# EAGLE board M847 (EAGLE 6.6.0), part 1 of 3
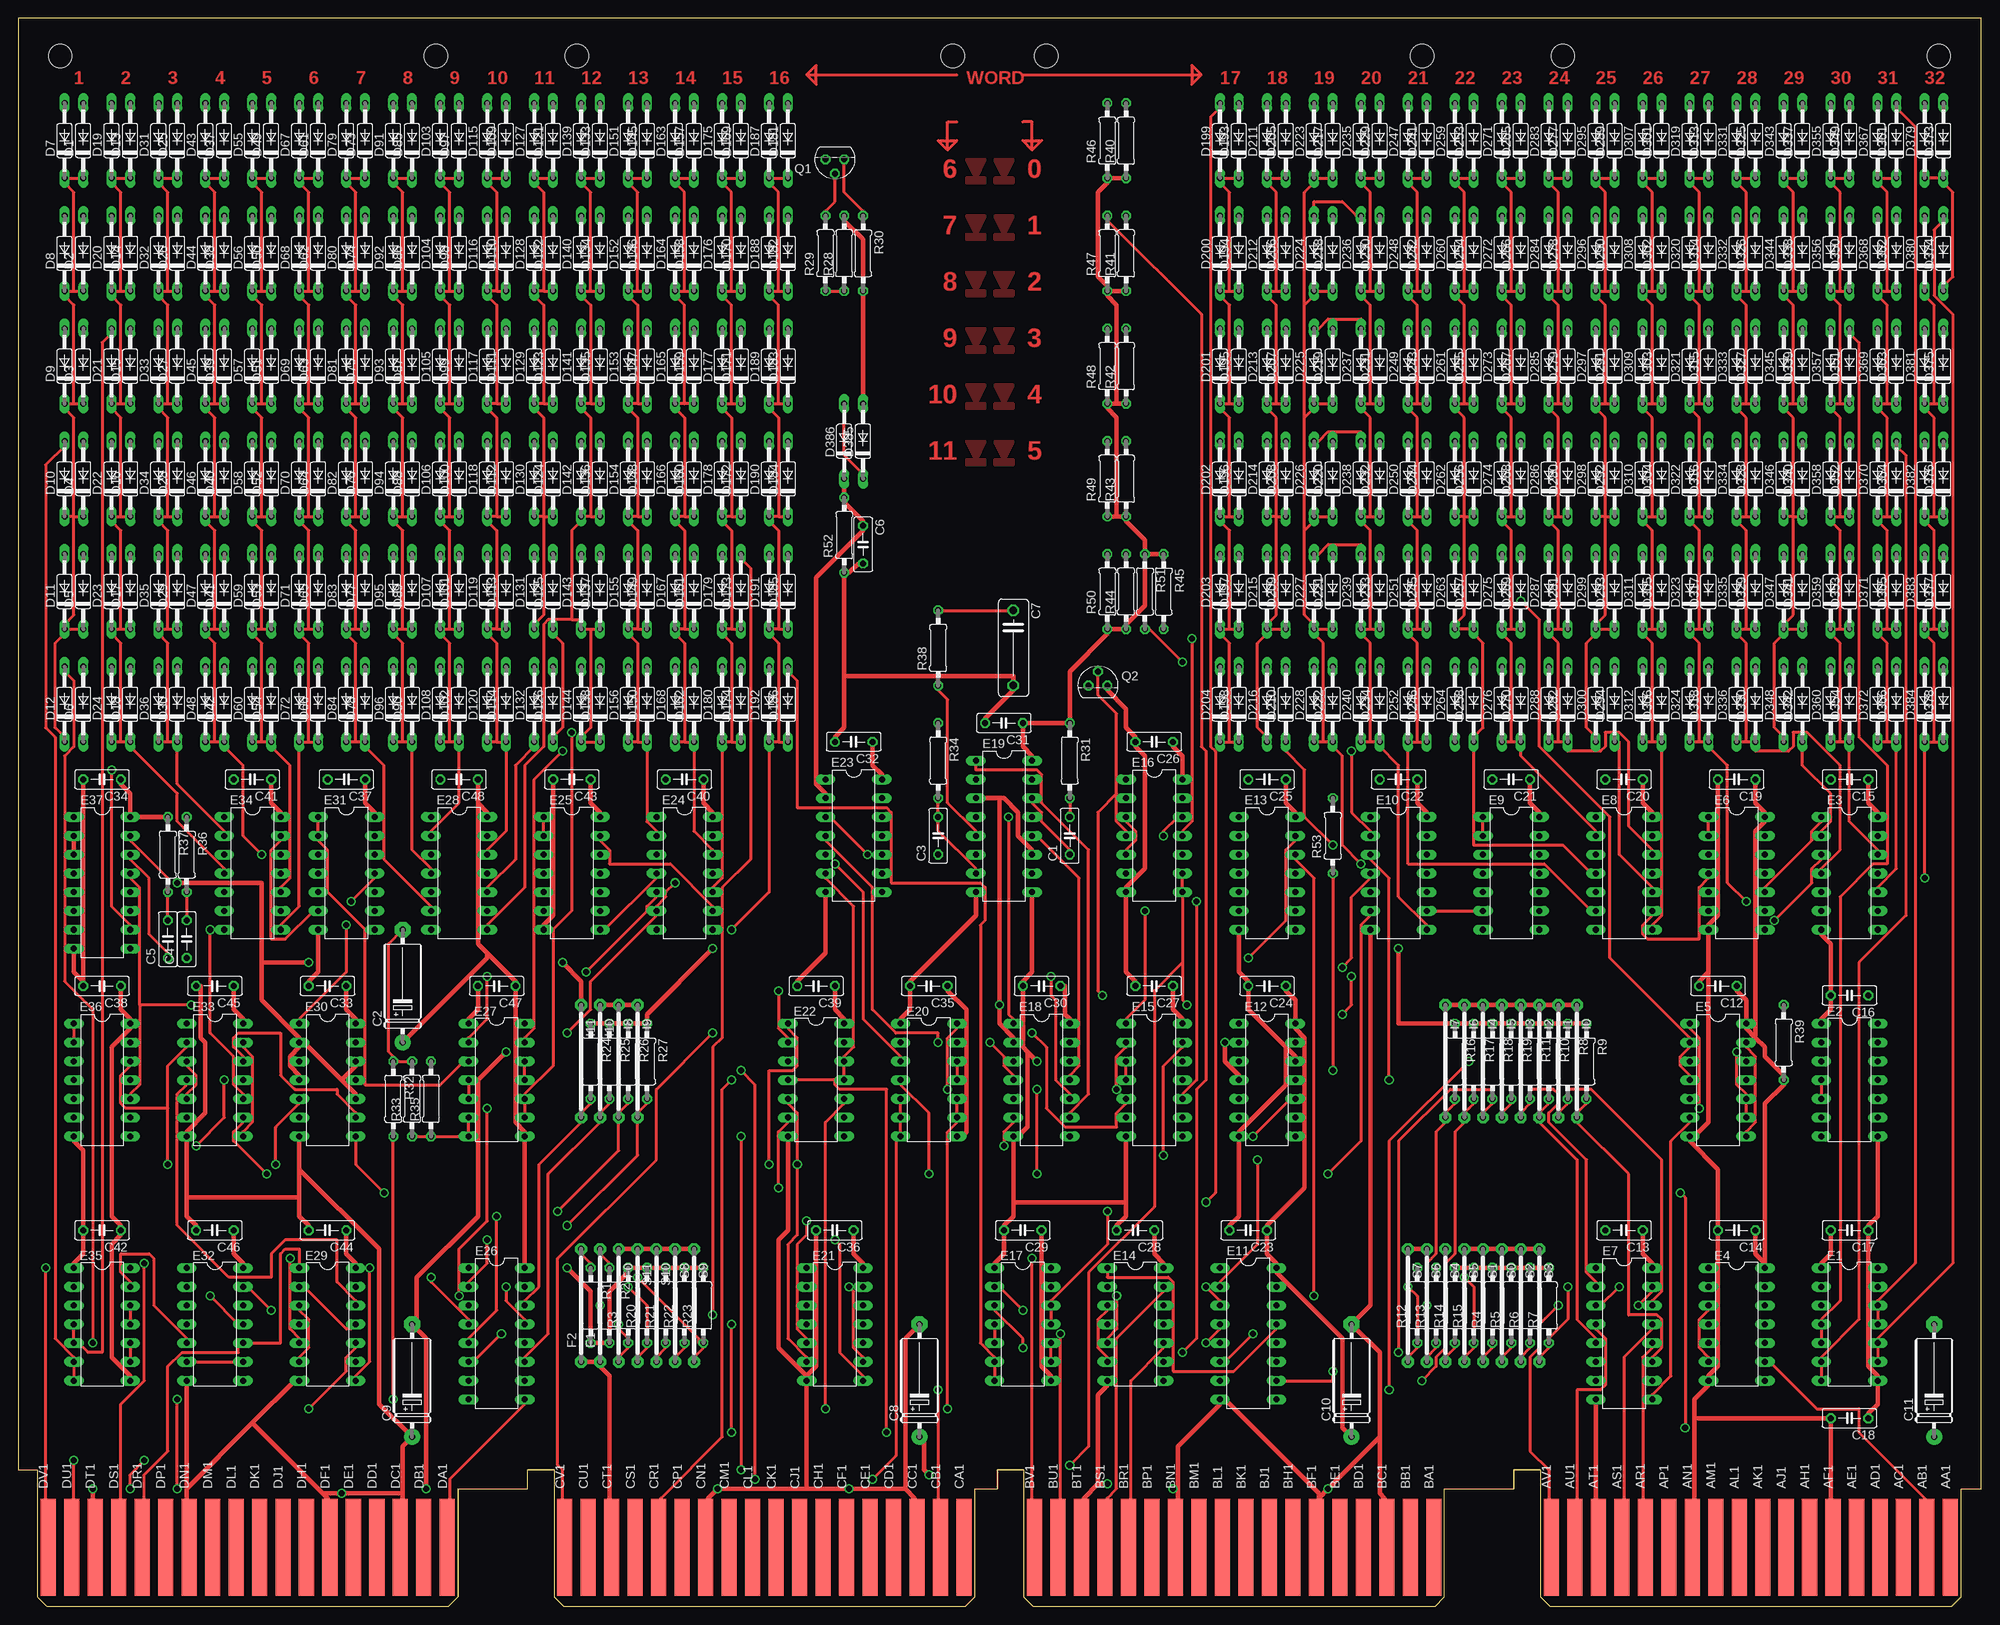
[diagram p3: board, top side]
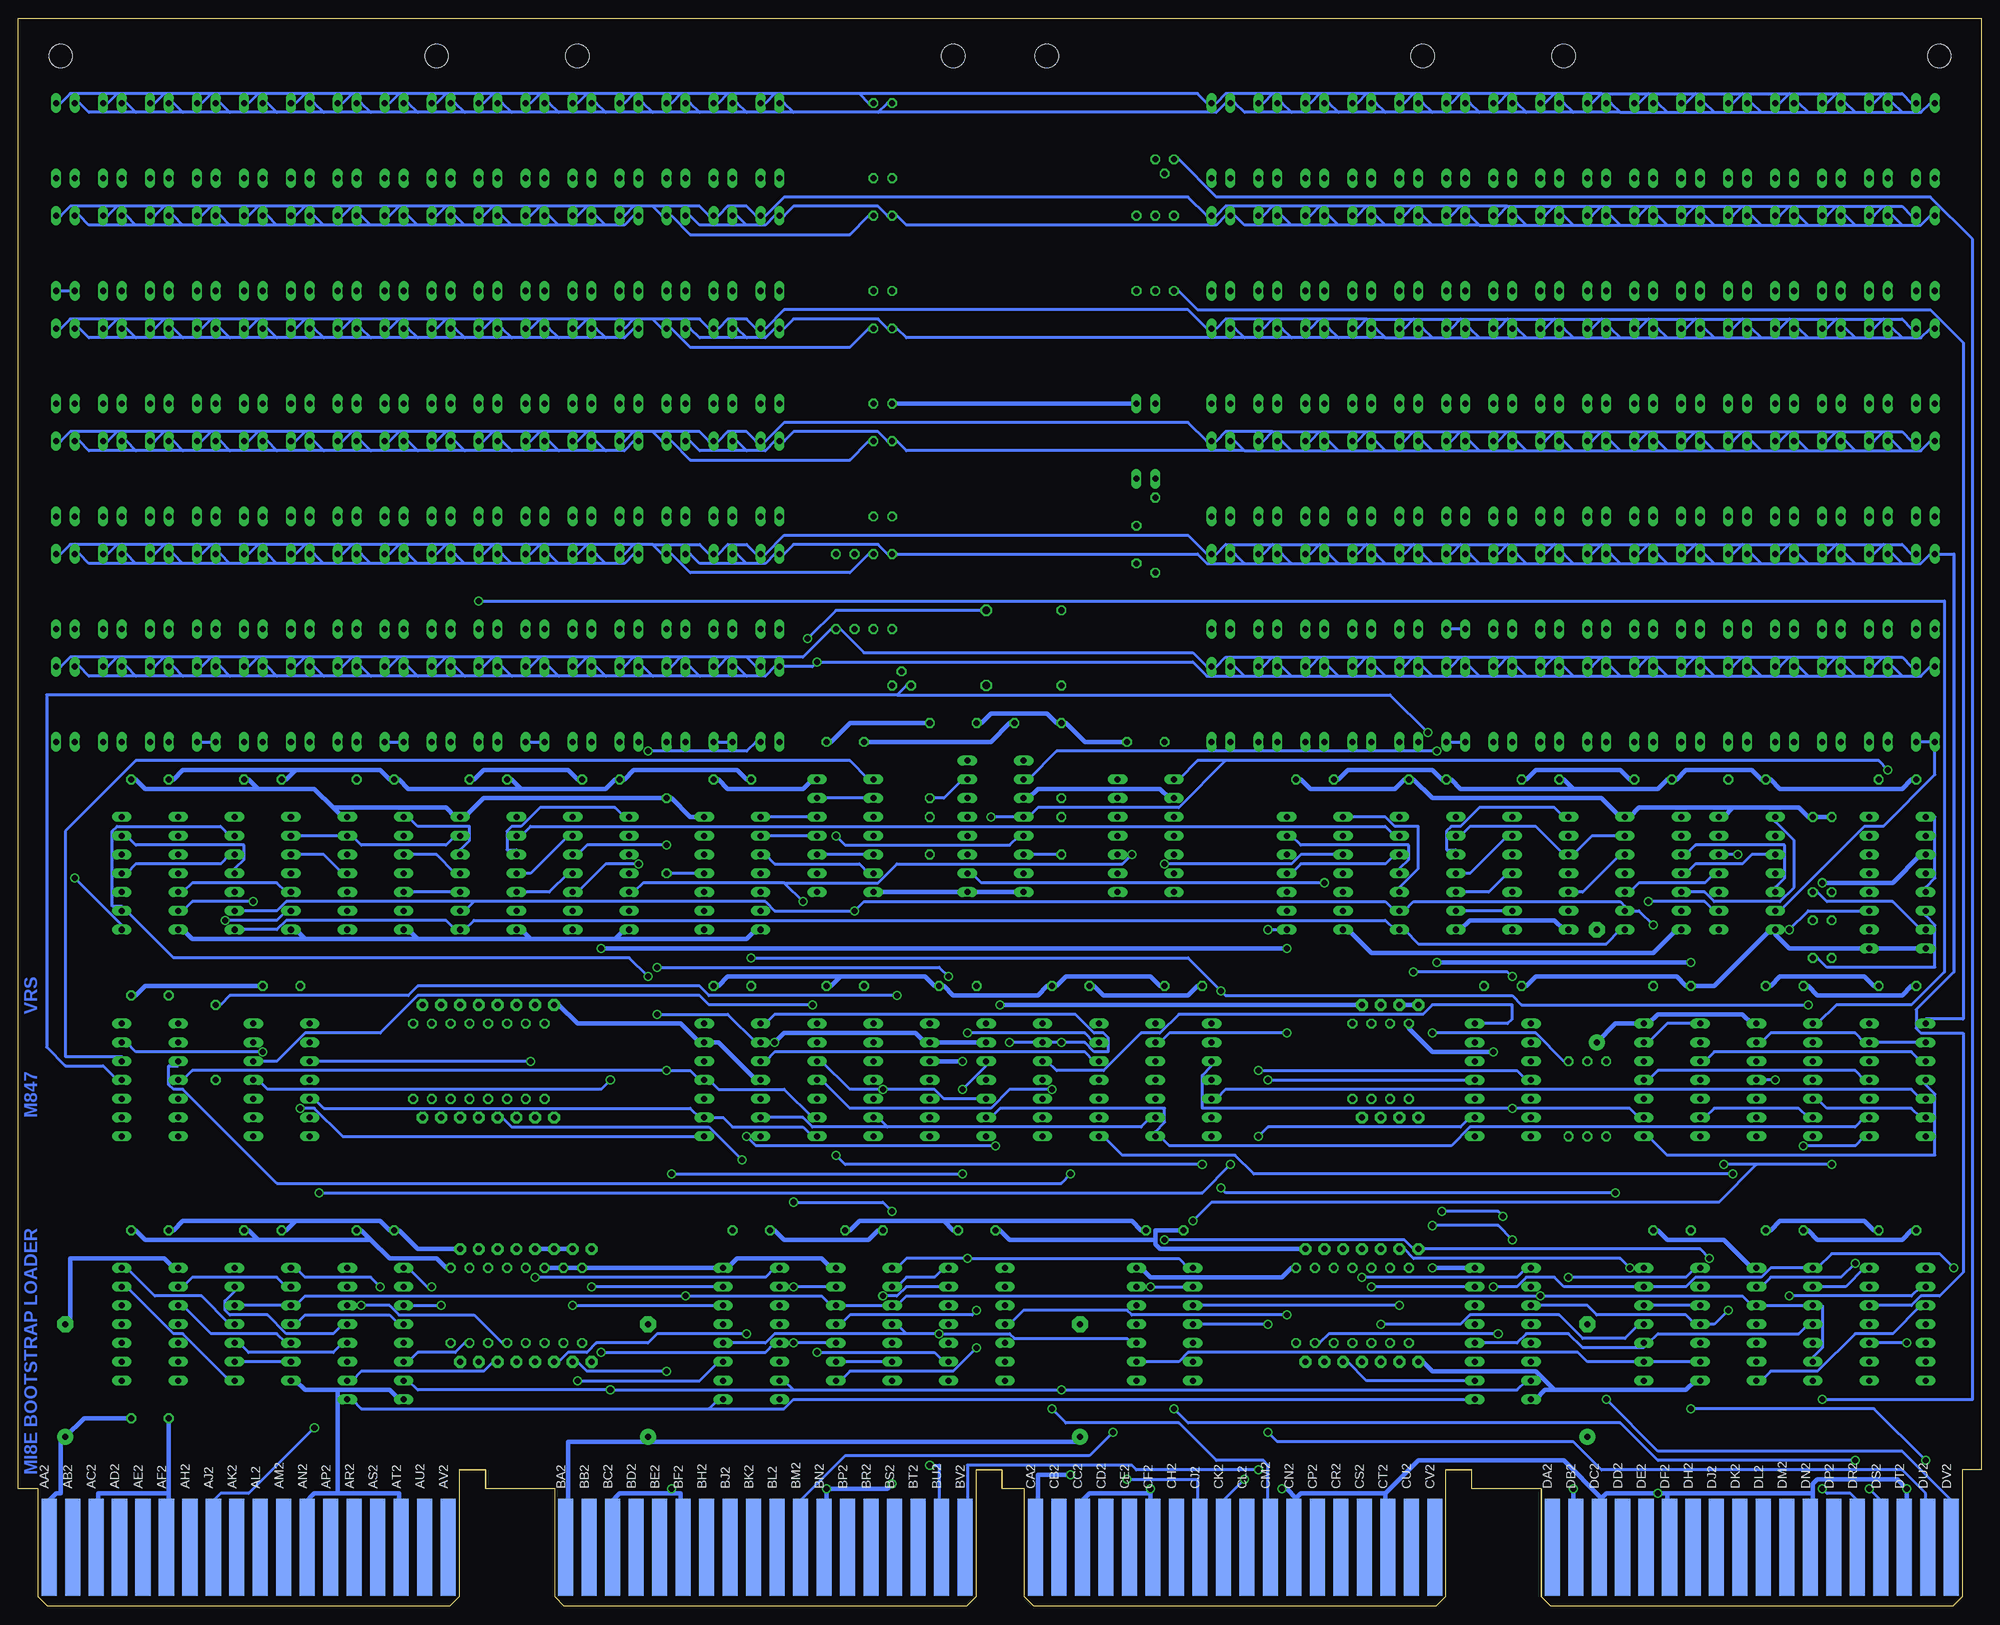
[diagram p4: board, bottom side, seen from below]

Size 265.3 x 214.63 mm. Coordinates in mm from the lower left corner, seen from the top.
Copper layers (1+16): Top 0.035mm / dielectric 1.5mm / Bottom 0.035mm
Design rules "16mils": minimum track width 16mil, minimum drill 32mil, track to track 15mil, track to pad 10mil, pad to pad 10mil, via to via 10mil, smd to smd 10mil, copper to edge 13mil, drill to drill 10mil, minimum pad ring 10mil, minimum via ring 8mil, stop-mask expansion 0mil, vias tented up to drill 0mil, thermal gap 10mil
Net classes: 1 supply: width 0.635 mm

## Footprints (pad centres in the part's own frame; a part is rotated, then mirrored left to right if it is on the bottom)
C050-025X075 = drill 0.813 octagon: 1 -2.54,0; 2 2.54,0
E15-5 = drill 0.813 pad 2.159: + -7.62,0 | drill 0.813 pad 2.159 octagon: - 7.62,0
C102-043X133 = drill 1.016 octagon: 1 -5.08,0; 2 5.08,0
DO35-10 = drill 0.813 long: A 5.08,0; C -5.08,0
DIL14 = drill 0.813 long: 1 -7.62,-3.81; 2 -5.08,-3.81; 3 -2.54,-3.81; 4 0,-3.81; 5 2.54,-3.81; 6 5.08,-3.81; 7 7.62,-3.81; 8 7.62,3.81; 9 5.08,3.81; 10 2.54,3.81; 11 0,3.81; 12 -2.54,3.81; 13 -5.08,3.81; 14 -7.62,3.81
DIL16 = drill 0.813 long: 1 -8.89,-3.81; 2 -6.35,-3.81; 3 -3.81,-3.81; 4 -1.27,-3.81; 5 1.27,-3.81; 6 3.81,-3.81; 7 6.35,-3.81; 8 8.89,-3.81; 9 8.89,3.81; 10 6.35,3.81; 11 3.81,3.81; 12 1.27,3.81; 13 -1.27,3.81; 14 -3.81,3.81; 15 -6.35,3.81; 16 -8.89,3.81
15 = drill 0.813 pad 1.6 octagon: 1 -7.62,0; 2 7.62,0
TO92 = drill 0.813 octagon: 1 1.27,0; 2 0,1.905; 3 -1.27,0
0207/10 = drill 0.813 octagon: 1 -5.08,0; 2 5.08,0
OMNIBUS = hole 3.175: 208.915,209.55; 259.715,209.55; 189.865,209.55; 139.065,209.55; 75.616,209.55; 126.416,209.55; 56.566,209.55; 5.766,209.55
EDGE-CON8 = smd 2.032 x 13.106: AA1 261.303,7.938; AB1 258.127,7.938; AC1 254.952,7.938; AD1 251.778,7.938; AE1 248.602,7.938; AF1 245.428,7.938; AH1 242.252,7.938; AJ1 239.077,7.938; AK1 235.903,7.938; AL1 232.727,7.938; AM1 229.553,7.938; AN1 226.377,7.938; AP1 223.202,7.938; AR1 220.028,7.938; AS1 216.852,7.938; AT1 213.678,7.938; AU1 210.502,7.938; AV1 207.327,7.938; BA1 191.452,7.938; BB1 188.278,7.938; BC1 185.102,7.938; BD1 181.928,7.938; BE1 178.752,7.938; BF1 175.577,7.938; BH1 172.403,7.938; BJ1 169.227,7.938; BK1 166.053,7.938; BL1 162.877,7.938; BM1 159.702,7.938; BN1 156.528,7.938; BP1 153.352,7.938; BR1 150.178,7.938; BS1 147.002,7.938; BT1 143.827,7.938; BU1 140.653,7.938; BV1 137.477,7.938; CA1 127.953,7.938; CB1 124.778,7.938; CC1 121.603,7.938; CD1 118.427,7.938; CE1 115.252,7.938; CF1 112.078,7.938; CH1 108.903,7.938; CJ1 105.728,7.938; CK1 102.552,7.938; CL1 99.377,7.938; CM1 96.203,7.938; CN1 93.028,7.938; CP1 89.853,7.938; CR1 86.677,7.938; CS1 83.502,7.938; CT1 80.328,7.938; CU1 77.153,7.938; CV1 73.978,7.938; DA1 58.102,7.938; DB1 54.928,7.938; DC1 51.752,7.938; DD1 48.578,7.938; DE1 45.403,7.938; DF1 42.227,7.938; DH1 39.053,7.938; DJ1 35.877,7.938; DK1 32.703,7.938; DL1 29.527,7.938; DM1 26.352,7.938; DN1 23.177,7.938; DP1 20.003,7.938; DR1 16.828,7.938; DS1 13.652,7.938; DT1 10.477,7.938; DU1 7.303,7.938; DV1 4.128,7.938 | smd 2.032 x 13.106 bottom: AA2 261.303,7.938; AB2 258.127,7.938; AC2 254.952,7.938; AD2 251.778,7.938; AE2 248.602,7.938; AF2 245.428,7.938; AH2 242.252,7.938; AJ2 239.077,7.938; AK2 235.903,7.938; AL2 232.727,7.938; AM2 229.553,7.938; AN2 226.377,7.938; AP2 223.202,7.938; AR2 220.028,7.938; AS2 216.852,7.938; AT2 213.678,7.938; AU2 210.502,7.938; AV2 207.327,7.938; BA2 191.452,7.938; BB2 188.278,7.938; BC2 185.102,7.938; BD2 181.928,7.938; BE2 178.752,7.938; BF2 175.577,7.938; BH2 172.403,7.938; BJ2 169.227,7.938; BK2 166.053,7.938; BL2 162.877,7.938; BM2 159.702,7.938; BN2 156.528,7.938; BP2 153.352,7.938; BR2 150.178,7.938; BS2 147.002,7.938; BT2 143.827,7.938; BU2 140.653,7.938; BV2 137.477,7.938; CA2 127.953,7.938; CB2 124.778,7.938; CC2 121.603,7.938; CD2 118.427,7.938; CE2 115.252,7.938; CF2 112.078,7.938; CH2 108.903,7.938; CJ2 105.728,7.938; CK2 102.552,7.938; CL2 99.377,7.938; CM2 96.203,7.938; CN2 93.028,7.938; CP2 89.853,7.938; CR2 86.677,7.938; CS2 83.502,7.938; CT2 80.328,7.938; CU2 77.153,7.938; CV2 73.978,7.938; DA2 58.102,7.938; DB2 54.928,7.938; DC2 51.752,7.938; DD2 48.578,7.938; DE2 45.403,7.938; DF2 42.227,7.938; DH2 39.053,7.938; DJ2 35.877,7.938; DK2 32.703,7.938; DL2 29.527,7.938; DM2 26.352,7.938; DN2 23.177,7.938; DP2 20.003,7.938; DR2 16.828,7.938; DS2 13.652,7.938; DT2 10.477,7.938; DU2 7.303,7.938; DV2 4.128,7.938

## Placement (x,y rotation side)
C1  27pf  [C050-025X075]  142.11,104.14 90 top
C2  39uf  [E15-5]  51.94,83.82 90 top
C3  150pf  [C050-025X075]  124.33,104.14 90 top
C4  68pf  [C050-025X075]  22.73,90.17 90 top
C5  27pf  [C050-025X075]  20.19,90.17 90 top
C6  27pf  [C050-025X075]  114.17,143.51 270 top
C7  2700pf  [C102-043X133]  134.49,129.54 270 top
C8  6.8uf  [E15-5]  121.79,30.48 90 top
C9  6.8uf  [E15-5]  53.21,30.48 90 top
C10  6.8uf  [E15-5]  180.21,30.48 90 top
C11  6.8uf  [E15-5]  258.95,30.48 90 top
C12  .01uf  [C050-025X075]  229.74,83.82 180 top
C13  .01uf  [C050-025X075]  217.04,50.8 180 top
C14  .01uf  [C050-025X075]  232.28,50.8 180 top
C15  .01uf  [C050-025X075]  247.52,111.76 180 top
C16  .01uf  [C050-025X075]  247.52,82.55 180 top
C17  .01uf  [C050-025X075]  247.52,50.8 180 top
C18  .01uf  [C050-025X075]  247.52,25.4 180 top
C19  .01uf  [C050-025X075]  232.28,111.76 180 top
C20  .01uf  [C050-025X075]  217.04,111.76 180 top
C21  .01uf  [C050-025X075]  201.8,111.76 180 top
C22  .01uf  [C050-025X075]  186.56,111.76 180 top
C23  .01uf  [C050-025X075]  166.24,50.8 180 top
C24  .01uf  [C050-025X075]  168.78,83.82 180 top
C25  .01uf  [C050-025X075]  168.78,111.76 180 top
C26  .01uf  [C050-025X075]  153.54,116.84 180 top
C27  .01uf  [C050-025X075]  153.54,83.82 180 top
C28  .01uf  [C050-025X075]  151,50.8 180 top
C29  .01uf  [C050-025X075]  135.76,50.8 180 top
C30  .01uf  [C050-025X075]  138.3,83.82 180 top
C31  .01uf  [C050-025X075]  133.22,119.38 180 top
C32  .01uf  [C050-025X075]  112.9,116.84 180 top
C33  .01uf  [C050-025X075]  41.78,83.82 180 top
C34  .01uf  [C050-025X075]  11.3,111.76 180 top
C35  .01uf  [C050-025X075]  123.06,83.82 180 top
C36  .01uf  [C050-025X075]  110.36,50.8 180 top
C37  .01uf  [C050-025X075]  44.32,111.76 180 top
C38  .01uf  [C050-025X075]  11.3,83.82 180 top
C39  .01uf  [C050-025X075]  107.82,83.82 180 top
C40  .01uf  [C050-025X075]  90.04,111.76 180 top
C41  .01uf  [C050-025X075]  31.62,111.76 180 top
C42  .01uf  [C050-025X075]  11.3,50.8 180 top
C43  .01uf  [C050-025X075]  74.8,111.76 180 top
C44  .01uf  [C050-025X075]  41.78,50.8 180 top
C45  .01uf  [C050-025X075]  26.54,83.82 180 top
C46  .01uf  [C050-025X075]  26.54,50.8 180 top
C47  .01uf  [C050-025X075]  64.64,83.82 180 top
C48  .01uf  [C050-025X075]  59.56,111.76 180 top
D1  D664  [DO35-10]  8.76,198.12 90 top
D2  D664  [DO35-10]  8.76,182.88 90 top
D3  D664  [DO35-10]  8.76,167.64 90 top
D4  D664  [DO35-10]  8.76,152.4 90 top
D5  D664  [DO35-10]  8.76,137.16 90 top
D6  D664  [DO35-10]  8.76,121.92 90 top
D7  D664  [DO35-10]  6.22,198.12 90 top
D8  D664  [DO35-10]  6.22,182.88 90 top
D9  D664  [DO35-10]  6.22,167.64 90 top
D10  D664  [DO35-10]  6.22,152.4 90 top
D11  D664  [DO35-10]  6.22,137.16 90 top
D12  D664  [DO35-10]  6.22,121.92 90 top
D13  D664  [DO35-10]  15.11,198.12 90 top
D14  D664  [DO35-10]  15.11,182.88 90 top
D15  D664  [DO35-10]  15.11,167.64 90 top
D16  D664  [DO35-10]  15.11,152.4 90 top
D17  D664  [DO35-10]  15.11,137.16 90 top
D18  D664  [DO35-10]  15.11,121.92 90 top
D19  D664  [DO35-10]  12.57,198.12 90 top
D20  D664  [DO35-10]  12.57,182.88 90 top
D21  D664  [DO35-10]  12.57,167.64 90 top
D22  D664  [DO35-10]  12.57,152.4 90 top
D23  D664  [DO35-10]  12.57,137.16 90 top
D24  D664  [DO35-10]  12.57,121.92 90 top
D25  D664  [DO35-10]  21.46,198.12 90 top
D26  D664  [DO35-10]  21.46,182.88 90 top
D27  D664  [DO35-10]  21.46,167.64 90 top
D28  D664  [DO35-10]  21.46,152.4 90 top
D29  D664  [DO35-10]  21.46,137.16 90 top
D30  D664  [DO35-10]  21.46,121.92 90 top
D31  D664  [DO35-10]  18.92,198.12 90 top
D32  D664  [DO35-10]  18.92,182.88 90 top
D33  D664  [DO35-10]  18.92,167.64 90 top
D34  D664  [DO35-10]  18.92,152.4 90 top
D35  D664  [DO35-10]  18.92,137.16 90 top
D36  D664  [DO35-10]  18.92,121.92 90 top
D37  D664  [DO35-10]  27.81,198.12 90 top
D38  D664  [DO35-10]  27.81,182.88 90 top
D39  D664  [DO35-10]  27.81,167.64 90 top
D40  D664  [DO35-10]  27.81,152.4 90 top
D41  D664  [DO35-10]  27.81,137.16 90 top
D42  D664  [DO35-10]  27.81,121.92 90 top
D43  D664  [DO35-10]  25.27,198.12 90 top
D44  D664  [DO35-10]  25.27,182.88 90 top
D45  D664  [DO35-10]  25.27,167.64 90 top
D46  D664  [DO35-10]  25.27,152.4 90 top
D47  D664  [DO35-10]  25.27,137.16 90 top
D48  D664  [DO35-10]  25.27,121.92 90 top
D49  D664  [DO35-10]  34.16,198.12 90 top
D50  D664  [DO35-10]  34.16,182.88 90 top
D51  D664  [DO35-10]  34.16,167.64 90 top
D52  D664  [DO35-10]  34.16,152.4 90 top
D53  D664  [DO35-10]  34.16,137.16 90 top
D54  D664  [DO35-10]  34.16,121.92 90 top
D55  D664  [DO35-10]  31.62,198.12 90 top
D56  D664  [DO35-10]  31.62,182.88 90 top
D57  D664  [DO35-10]  31.62,167.64 90 top
D58  D664  [DO35-10]  31.62,152.4 90 top
D59  D664  [DO35-10]  31.62,137.16 90 top
D60  D664  [DO35-10]  31.62,121.92 90 top
D61  D664  [DO35-10]  40.51,198.12 90 top
D62  D664  [DO35-10]  40.51,182.88 90 top
D63  D664  [DO35-10]  40.51,167.64 90 top
D64  D664  [DO35-10]  40.51,152.4 90 top
D65  D664  [DO35-10]  40.51,137.16 90 top
D66  D664  [DO35-10]  40.51,121.92 90 top
D67  D664  [DO35-10]  37.97,198.12 90 top
D68  D664  [DO35-10]  37.97,182.88 90 top
D69  D664  [DO35-10]  37.97,167.64 90 top
D70  D664  [DO35-10]  37.97,152.4 90 top
D71  D664  [DO35-10]  37.97,137.16 90 top
D72  D664  [DO35-10]  37.97,121.92 90 top
D73  D664  [DO35-10]  46.86,198.12 90 top
D74  D664  [DO35-10]  46.86,182.88 90 top
D75  D664  [DO35-10]  46.86,167.64 90 top
D76  D664  [DO35-10]  46.86,152.4 90 top
D77  D664  [DO35-10]  46.86,137.16 90 top
D78  D664  [DO35-10]  46.86,121.92 90 top
D79  D664  [DO35-10]  44.32,198.12 90 top
D80  D664  [DO35-10]  44.32,182.88 90 top
D81  D664  [DO35-10]  44.32,167.64 90 top
D82  D664  [DO35-10]  44.32,152.4 90 top
D83  D664  [DO35-10]  44.32,137.16 90 top
D84  D664  [DO35-10]  44.32,121.92 90 top
D85  D664  [DO35-10]  53.21,198.12 90 top
D86  D664  [DO35-10]  53.21,182.88 90 top
D87  D664  [DO35-10]  53.21,167.64 90 top
D88  D664  [DO35-10]  53.21,152.4 90 top
D89  D664  [DO35-10]  53.21,137.16 90 top
D90  D664  [DO35-10]  53.21,121.92 90 top
D91  D664  [DO35-10]  50.67,198.12 90 top
D92  D664  [DO35-10]  50.67,182.88 90 top
D93  D664  [DO35-10]  50.67,167.64 90 top
D94  D664  [DO35-10]  50.67,152.4 90 top
D95  D664  [DO35-10]  50.67,137.16 90 top
D96  D664  [DO35-10]  50.67,121.92 90 top
D97  D664  [DO35-10]  59.56,198.12 90 top
D98  D664  [DO35-10]  59.56,182.88 90 top
D99  D664  [DO35-10]  59.56,167.64 90 top
D100  D664  [DO35-10]  59.56,152.4 90 top
D101  D664  [DO35-10]  59.56,137.16 90 top
D102  D664  [DO35-10]  59.56,121.92 90 top
D103  D664  [DO35-10]  57.02,198.12 90 top
D104  D664  [DO35-10]  57.02,182.88 90 top
D105  D664  [DO35-10]  57.02,167.64 90 top
D106  D664  [DO35-10]  57.02,152.4 90 top
D107  D664  [DO35-10]  57.02,137.16 90 top
D108  D664  [DO35-10]  57.02,121.92 90 top
D109  D664  [DO35-10]  65.91,198.12 90 top
D110  D664  [DO35-10]  65.91,182.88 90 top
D111  D664  [DO35-10]  65.91,167.64 90 top
D112  D664  [DO35-10]  65.91,152.4 90 top
D113  D664  [DO35-10]  65.91,137.16 90 top
D114  D664  [DO35-10]  65.91,121.92 90 top
D115  D664  [DO35-10]  63.37,198.12 90 top
D116  D664  [DO35-10]  63.37,182.88 90 top
D117  D664  [DO35-10]  63.37,167.64 90 top
D118  D664  [DO35-10]  63.37,152.4 90 top
D119  D664  [DO35-10]  63.37,137.16 90 top
D120  D664  [DO35-10]  63.37,121.92 90 top
D121  D664  [DO35-10]  72.26,198.12 90 top
D122  D664  [DO35-10]  72.26,182.88 90 top
D123  D664  [DO35-10]  72.26,167.64 90 top
D124  D664  [DO35-10]  72.26,152.4 90 top
D125  D664  [DO35-10]  72.26,137.16 90 top
D126  D664  [DO35-10]  72.26,121.92 90 top
D127  D664  [DO35-10]  69.72,198.12 90 top
D128  D664  [DO35-10]  69.72,182.88 90 top
D129  D664  [DO35-10]  69.72,167.64 90 top
D130  D664  [DO35-10]  69.72,152.4 90 top
D131  D664  [DO35-10]  69.72,137.16 90 top
D132  D664  [DO35-10]  69.72,121.92 90 top
D133  D664  [DO35-10]  78.61,198.12 90 top
D134  D664  [DO35-10]  78.61,182.88 90 top
D135  D664  [DO35-10]  78.61,167.64 90 top
D136  D664  [DO35-10]  78.61,152.4 90 top
D137  D664  [DO35-10]  78.61,137.16 90 top
D138  D664  [DO35-10]  78.61,121.92 90 top
D139  D664  [DO35-10]  76.07,198.12 90 top
D140  D664  [DO35-10]  76.07,182.88 90 top
D141  D664  [DO35-10]  76.07,167.64 90 top
D142  D664  [DO35-10]  76.07,152.4 90 top
D143  D664  [DO35-10]  76.07,137.16 90 top
D144  D664  [DO35-10]  76.07,121.92 90 top
D145  D664  [DO35-10]  84.96,198.12 90 top
D146  D664  [DO35-10]  84.96,182.88 90 top
D147  D664  [DO35-10]  84.96,167.64 90 top
D148  D664  [DO35-10]  84.96,152.4 90 top
D149  D664  [DO35-10]  84.96,137.16 90 top
D150  D664  [DO35-10]  84.96,121.92 90 top
D151  D664  [DO35-10]  82.42,198.12 90 top
D152  D664  [DO35-10]  82.42,182.88 90 top
D153  D664  [DO35-10]  82.42,167.64 90 top
D154  D664  [DO35-10]  82.42,152.4 90 top
D155  D664  [DO35-10]  82.42,137.16 90 top
D156  D664  [DO35-10]  82.42,121.92 90 top
D157  D664  [DO35-10]  91.31,198.12 90 top
D158  D664  [DO35-10]  91.31,182.88 90 top
D159  D664  [DO35-10]  91.31,167.64 90 top
D160  D664  [DO35-10]  91.31,152.4 90 top
D161  D664  [DO35-10]  91.31,137.16 90 top
D162  D664  [DO35-10]  91.31,121.92 90 top
D163  D664  [DO35-10]  88.77,198.12 90 top
D164  D664  [DO35-10]  88.77,182.88 90 top
D165  D664  [DO35-10]  88.77,167.64 90 top
D166  D664  [DO35-10]  88.77,152.4 90 top
D167  D664  [DO35-10]  88.77,137.16 90 top
D168  D664  [DO35-10]  88.77,121.92 90 top
D169  D664  [DO35-10]  97.66,198.12 90 top
D170  D664  [DO35-10]  97.66,182.88 90 top
D171  D664  [DO35-10]  97.66,167.64 90 top
D172  D664  [DO35-10]  97.66,152.4 90 top
D173  D664  [DO35-10]  97.66,137.16 90 top
D174  D664  [DO35-10]  97.66,121.92 90 top
D175  D664  [DO35-10]  95.12,198.12 90 top
D176  D664  [DO35-10]  95.12,182.88 90 top
D177  D664  [DO35-10]  95.12,167.64 90 top
D178  D664  [DO35-10]  95.12,152.4 90 top
D179  D664  [DO35-10]  95.12,137.16 90 top
D180  D664  [DO35-10]  95.12,121.92 90 top
D181  D664  [DO35-10]  104.01,198.12 90 top
D182  D664  [DO35-10]  104.01,182.88 90 top
D183  D664  [DO35-10]  104.01,167.64 90 top
D184  D664  [DO35-10]  104.01,152.4 90 top
D185  D664  [DO35-10]  104.01,137.16 90 top
D186  D664  [DO35-10]  104.01,121.92 90 top
D187  D664  [DO35-10]  101.47,198.12 90 top
D188  D664  [DO35-10]  101.47,182.88 90 top
D189  D664  [DO35-10]  101.47,167.64 90 top
D190  D664  [DO35-10]  101.47,152.4 90 top
D191  D664  [DO35-10]  101.47,137.16 90 top
D192  D664  [DO35-10]  101.47,121.92 90 top
D193  D664  [DO35-10]  164.97,198.12 90 top
D194  D664  [DO35-10]  164.97,182.88 90 top
D195  D664  [DO35-10]  164.97,167.64 90 top
D196  D664  [DO35-10]  164.97,152.4 90 top
D197  D664  [DO35-10]  164.97,137.16 90 top
D198  D664  [DO35-10]  164.97,121.92 90 top
D199  D664  [DO35-10]  162.43,198.12 90 top
D200  D664  [DO35-10]  162.43,182.88 90 top
D201  D664  [DO35-10]  162.43,167.64 90 top
D202  D664  [DO35-10]  162.43,152.4 90 top
D203  D664  [DO35-10]  162.43,137.16 90 top
D204  D664  [DO35-10]  162.43,121.92 90 top
D205  D664  [DO35-10]  171.32,198.12 90 top
D206  D664  [DO35-10]  171.32,182.88 90 top
D207  D664  [DO35-10]  171.32,167.64 90 top
D208  D664  [DO35-10]  171.32,152.4 90 top
D209  D664  [DO35-10]  171.32,137.16 90 top
D210  D664  [DO35-10]  171.32,121.92 90 top
D211  D664  [DO35-10]  168.78,198.12 90 top
D212  D664  [DO35-10]  168.78,182.88 90 top
D213  D664  [DO35-10]  168.78,167.64 90 top
D214  D664  [DO35-10]  168.78,152.4 90 top
D215  D664  [DO35-10]  168.78,137.16 90 top
D216  D664  [DO35-10]  168.78,121.92 90 top
D217  D664  [DO35-10]  177.67,198.12 90 top
D218  D664  [DO35-10]  177.67,182.88 90 top
D219  D664  [DO35-10]  177.67,167.64 90 top
D220  D664  [DO35-10]  177.67,152.4 90 top
D221  D664  [DO35-10]  177.67,137.16 90 top
D222  D664  [DO35-10]  177.67,121.92 90 top
D223  D664  [DO35-10]  175.13,198.12 90 top
D224  D664  [DO35-10]  175.13,182.88 90 top
D225  D664  [DO35-10]  175.13,167.64 90 top
D226  D664  [DO35-10]  175.13,152.4 90 top
D227  D664  [DO35-10]  175.13,137.16 90 top
D228  D664  [DO35-10]  175.13,121.92 90 top
D229  D664  [DO35-10]  184.02,198.12 90 top
D230  D664  [DO35-10]  184.02,182.88 90 top
D231  D664  [DO35-10]  184.02,167.64 90 top
D232  D664  [DO35-10]  184.02,152.4 90 top
D233  D664  [DO35-10]  184.02,137.16 90 top
D234  D664  [DO35-10]  184.02,121.92 90 top
D235  D664  [DO35-10]  181.48,198.12 90 top
D236  D664  [DO35-10]  181.48,182.88 90 top
D237  D664  [DO35-10]  181.48,167.64 90 top
D238  D664  [DO35-10]  181.48,152.4 90 top
D239  D664  [DO35-10]  181.48,137.16 90 top
D240  D664  [DO35-10]  181.48,121.92 90 top
D241  D664  [DO35-10]  190.37,198.12 90 top
D242  D664  [DO35-10]  190.37,182.88 90 top
D243  D664  [DO35-10]  190.37,167.64 90 top
D244  D664  [DO35-10]  190.37,152.4 90 top
D245  D664  [DO35-10]  190.37,137.16 90 top
D246  D664  [DO35-10]  190.37,121.92 90 top
D247  D664  [DO35-10]  187.83,198.12 90 top
D248  D664  [DO35-10]  187.83,182.88 90 top
D249  D664  [DO35-10]  187.83,167.64 90 top
D250  D664  [DO35-10]  187.83,152.4 90 top
D251  D664  [DO35-10]  187.83,137.16 90 top
D252  D664  [DO35-10]  187.83,121.92 90 top
D253  D664  [DO35-10]  196.72,198.12 90 top
D254  D664  [DO35-10]  196.72,182.88 90 top
D255  D664  [DO35-10]  196.72,167.64 90 top
D256  D664  [DO35-10]  196.72,152.4 90 top
D257  D664  [DO35-10]  196.72,137.16 90 top
D258  D664  [DO35-10]  196.72,121.92 90 top
D259  D664  [DO35-10]  194.18,198.12 90 top
D260  D664  [DO35-10]  194.18,182.88 90 top
D261  D664  [DO35-10]  194.18,167.64 90 top
D262  D664  [DO35-10]  194.18,152.4 90 top
D263  D664  [DO35-10]  194.18,137.16 90 top
D264  D664  [DO35-10]  194.18,121.92 90 top
D265  D664  [DO35-10]  203.07,198.12 90 top
D266  D664  [DO35-10]  203.07,182.88 90 top
D267  D664  [DO35-10]  203.07,167.64 90 top
D268  D664  [DO35-10]  203.07,152.4 90 top
D269  D664  [DO35-10]  203.07,137.16 90 top
D270  D664  [DO35-10]  203.07,121.92 90 top
D271  D664  [DO35-10]  200.53,198.12 90 top
D272  D664  [DO35-10]  200.53,182.88 90 top
D273  D664  [DO35-10]  200.53,167.64 90 top
D274  D664  [DO35-10]  200.53,152.4 90 top
D275  D664  [DO35-10]  200.53,137.16 90 top
D276  D664  [DO35-10]  200.53,121.92 90 top
D277  D664  [DO35-10]  209.42,198.12 90 top
D278  D664  [DO35-10]  209.42,182.88 90 top
D279  D664  [DO35-10]  209.42,167.64 90 top
D280  D664  [DO35-10]  209.42,152.4 90 top
D281  D664  [DO35-10]  209.42,137.16 90 top
D282  D664  [DO35-10]  209.42,121.92 90 top
D283  D664  [DO35-10]  206.88,198.12 90 top
D284  D664  [DO35-10]  206.88,182.88 90 top
D285  D664  [DO35-10]  206.88,167.64 90 top
D286  D664  [DO35-10]  206.88,152.4 90 top
D287  D664  [DO35-10]  206.88,137.16 90 top
D288  D664  [DO35-10]  206.88,121.92 90 top
D289  D664  [DO35-10]  215.77,198.12 90 top
D290  D664  [DO35-10]  215.77,182.88 90 top
D291  D664  [DO35-10]  215.77,167.64 90 top
D292  D664  [DO35-10]  215.77,152.4 90 top
D293  D664  [DO35-10]  215.77,137.16 90 top
D294  D664  [DO35-10]  215.77,121.92 90 top
D295  D664  [DO35-10]  213.23,198.12 90 top
D296  D664  [DO35-10]  213.23,182.88 90 top
D297  D664  [DO35-10]  213.23,167.64 90 top
D298  D664  [DO35-10]  213.23,152.4 90 top
D299  D664  [DO35-10]  213.23,137.16 90 top
D300  D664  [DO35-10]  213.23,121.92 90 top
D301  D664  [DO35-10]  222.12,198.12 90 top
D302  D664  [DO35-10]  222.12,182.88 90 top
D303  D664  [DO35-10]  222.12,167.64 90 top
D304  D664  [DO35-10]  222.12,152.4 90 top
D305  D664  [DO35-10]  222.12,137.16 90 top
D306  D664  [DO35-10]  222.12,121.92 90 top
D307  D664  [DO35-10]  219.58,198.12 90 top
D308  D664  [DO35-10]  219.58,182.88 90 top
D309  D664  [DO35-10]  219.58,167.64 90 top
D310  D664  [DO35-10]  219.58,152.4 90 top
D311  D664  [DO35-10]  219.58,137.16 90 top
D312  D664  [DO35-10]  219.58,121.92 90 top
D313  D664  [DO35-10]  228.47,198.12 90 top
D314  D664  [DO35-10]  228.47,182.88 90 top
D315  D664  [DO35-10]  228.47,167.64 90 top
D316  D664  [DO35-10]  228.47,152.4 90 top
D317  D664  [DO35-10]  228.47,137.16 90 top
D318  D664  [DO35-10]  228.47,121.92 90 top
D319  D664  [DO35-10]  225.93,198.12 90 top
D320  D664  [DO35-10]  225.93,182.88 90 top
D321  D664  [DO35-10]  225.93,167.64 90 top
D322  D664  [DO35-10]  225.93,152.4 90 top
D323  D664  [DO35-10]  225.93,137.16 90 top
D324  D664  [DO35-10]  225.93,121.92 90 top
D325  D664  [DO35-10]  234.82,198.12 90 top
D326  D664  [DO35-10]  234.82,182.88 90 top
D327  D664  [DO35-10]  234.82,167.64 90 top
D328  D664  [DO35-10]  234.82,152.4 90 top
D329  D664  [DO35-10]  234.82,137.16 90 top
D330  D664  [DO35-10]  234.82,121.92 90 top
D331  D664  [DO35-10]  232.28,198.12 90 top
D332  D664  [DO35-10]  232.28,182.88 90 top
D333  D664  [DO35-10]  232.28,167.64 90 top
D334  D664  [DO35-10]  232.28,152.4 90 top
D335  D664  [DO35-10]  232.28,137.16 90 top
D336  D664  [DO35-10]  232.28,121.92 90 top
D337  D664  [DO35-10]  241.17,198.12 90 top
D338  D664  [DO35-10]  241.17,182.88 90 top
D339  D664  [DO35-10]  241.17,167.64 90 top
D340  D664  [DO35-10]  241.17,152.4 90 top
D341  D664  [DO35-10]  241.17,137.16 90 top
D342  D664  [DO35-10]  241.17,121.92 90 top
D343  D664  [DO35-10]  238.63,198.12 90 top
D344  D664  [DO35-10]  238.63,182.88 90 top
D345  D664  [DO35-10]  238.63,167.64 90 top
D346  D664  [DO35-10]  238.63,152.4 90 top
D347  D664  [DO35-10]  238.63,137.16 90 top
D348  D664  [DO35-10]  238.63,121.92 90 top
D349  D664  [DO35-10]  247.52,198.12 90 top
D350  D664  [DO35-10]  247.52,182.88 90 top
D351  D664  [DO35-10]  247.52,167.64 90 top
D352  D664  [DO35-10]  247.52,152.4 90 top
D353  D664  [DO35-10]  247.52,137.16 90 top
D354  D664  [DO35-10]  247.52,121.92 90 top
D355  D664  [DO35-10]  244.98,198.12 90 top
D356  D664  [DO35-10]  244.98,182.88 90 top
D357  D664  [DO35-10]  244.98,167.64 90 top
D358  D664  [DO35-10]  244.98,152.4 90 top
D359  D664  [DO35-10]  244.98,137.16 90 top
D360  D664  [DO35-10]  244.98,121.92 90 top
D361  D664  [DO35-10]  253.87,198.12 90 top
D362  D664  [DO35-10]  253.87,182.88 90 top
D363  D664  [DO35-10]  253.87,167.64 90 top
D364  D664  [DO35-10]  253.87,152.4 90 top
D365  D664  [DO35-10]  253.87,137.16 90 top
D366  D664  [DO35-10]  253.87,121.92 90 top
D367  D664  [DO35-10]  251.33,198.12 90 top
D368  D664  [DO35-10]  251.33,182.88 90 top
D369  D664  [DO35-10]  251.33,167.64 90 top
D370  D664  [DO35-10]  251.33,152.4 90 top
D371  D664  [DO35-10]  251.33,137.16 90 top
D372  D664  [DO35-10]  251.33,121.92 90 top
D373  D664  [DO35-10]  260.22,198.12 90 top
D374  D664  [DO35-10]  260.22,182.88 90 top
D375  D664  [DO35-10]  260.22,167.64 90 top
D376  D664  [DO35-10]  260.22,152.4 90 top
D377  D664  [DO35-10]  260.22,137.16 90 top
D378  D664  [DO35-10]  260.22,121.92 90 top
D379  D664  [DO35-10]  257.68,198.12 90 top
D380  D664  [DO35-10]  257.68,182.88 90 top
D381  D664  [DO35-10]  257.68,167.64 90 top
D382  D664  [DO35-10]  257.68,152.4 90 top
D383  D664  [DO35-10]  257.68,137.16 90 top
D384  D664  [DO35-10]  257.68,121.92 90 top
D385  D664  [DO35-10]  114.17,157.48 90 top
D386  D664  [DO35-10]  111.63,157.48 90 top
E1  SP384N  [DIL14]  247.52,38.1 270 top
E2  SP380N  [DIL14]  247.52,71.12 270 top
E3  7404N  [DIL14]  247.52,99.06 270 top
E4  N8881N  [DIL14]  232.28,38.1 270 top
E5  7400N  [DIL14]  229.74,71.12 270 top
E6  74164N  [DIL14]  232.28,99.06 270 top
E7  DEC8235  [DIL16]  217.04,36.83 270 top
E8  7404N  [DIL14]  217.04,99.06 270 top
E9  74164N  [DIL14]  201.8,99.06 270 top
E10  7404N  [DIL14]  186.56,99.06 270 top
E11  DEC8235  [DIL16]  166.24,36.83 270 top
E12  74S74N  [DIL14]  168.78,71.12 270 top
E13  7400N  [DIL14]  168.78,99.06 270 top
E14  N8881N  [DIL14]  151,38.1 270 top
E15  7402N  [DIL14]  153.54,71.12 270 top
E16  7402N  [DIL14]  153.54,104.14 270 top
E17  SP384N  [DIL14]  135.76,38.1 270 top
E18  74S74N  [DIL14]  138.3,71.12 270 top
E19  74123N  [DIL16]  133.22,105.41 270 top
E20  SP380N  [DIL14]  123.06,71.12 270 top
E21  N8881N  [DIL14]  110.36,38.1 270 top
E22  N8881N  [DIL14]  107.82,71.12 270 top
E23  74S74N  [DIL14]  112.9,104.14 270 top
E24  7404N  [DIL14]  90.04,99.06 270 top
E25  74164N  [DIL14]  74.8,99.06 270 top
E26  DEC8235  [DIL16]  64.64,36.83 270 top
E27  SP380N  [DIL14]  64.64,71.12 270 top
E28  7404N  [DIL14]  59.56,99.06 270 top
E29  N8881N  [DIL14]  41.78,38.1 270 top
E30  74S74N  [DIL14]  41.78,71.12 270 top
E31  74164N  [DIL14]  44.32,99.06 270 top
E32  N8881N  [DIL14]  26.54,38.1 270 top
E33  7402N  [DIL14]  26.54,71.12 270 top
E34  7404N  [DIL14]  31.62,99.06 270 top
E35  SP384N  [DIL14]  11.3,38.1 270 top
E36  7400N  [DIL14]  11.3,71.12 270 top
E37  74123N  [DIL16]  11.3,97.79 270 top
F0  J15MM  [15]  81.15,40.64 270 top
F1  J15MM  [15]  78.61,40.64 90 top
F2  J15MM  [15]  76.07,40.64 90 top
I0  J15MM  [15]  210.69,73.66 270 top
I1  J15MM  [15]  208.15,73.66 270 top
I2  J15MM  [15]  205.61,73.66 270 top
I3  J15MM  [15]  203.07,73.66 270 top
I4  J15MM  [15]  197.99,73.66 270 top
I5  J15MM  [15]  200.53,73.66 270 top
I6  J15MM  [15]  195.45,73.66 270 top
I7  J15MM  [15]  192.91,73.66 270 top
I8  J15MM  [15]  81.15,73.66 270 top
I9  J15MM  [15]  83.69,73.66 270 top
I10  J15MM  [15]  78.61,73.66 270 top
I11  J15MM  [15]  76.07,73.66 270 top
Q1  DEC3009  [TO92]  110.36,195.58 180 top
Q2  DEC3009  [TO92]  145.92,124.46 0 top
R1  6.8K  [0207/10]  77.34,40.64 270 top
R2  6.8K  [0207/10]  79.88,40.64 270 top
R3  6.8K  [0207/10]  82.42,40.64 90 top
R4  6.8K  [0207/10]  199.26,40.64 90 top
R5  6.8K  [0207/10]  201.8,40.64 90 top
R6  6.8K  [0207/10]  204.34,40.64 90 top
R7  6.8K  [0207/10]  206.88,40.64 90 top
R8  6.8K  [0207/10]  209.42,73.66 270 top
R9  6.8K  [0207/10]  211.96,73.66 270 top
R10  6.8K  [0207/10]  206.88,73.66 270 top
R11  6.8K  [0207/10]  204.34,73.66 270 top
R12  6.8K  [0207/10]  189.1,40.64 90 top
R13  6.8K  [0207/10]  191.64,40.64 90 top
R14  6.8K  [0207/10]  194.18,40.64 90 top
R15  6.8K  [0207/10]  196.72,40.64 90 top
R16  6.8K  [0207/10]  194.18,73.66 270 top
R17  6.8K  [0207/10]  196.72,73.66 270 top
R18  6.8K  [0207/10]  199.26,73.66 270 top
R19  6.8K  [0207/10]  201.8,73.66 270 top
R20  6.8K  [0207/10]  84.96,40.64 90 top
R21  6.8K  [0207/10]  87.5,40.64 90 top
R22  6.8K  [0207/10]  90.04,40.64 90 top
R23  6.8K  [0207/10]  92.58,40.64 90 top
R24  6.8K  [0207/10]  77.34,73.66 270 top
R25  6.8K  [0207/10]  79.88,73.66 270 top
R26  6.8K  [0207/10]  82.42,73.66 270 top
R27  6.8K  [0207/10]  84.96,73.66 270 top
R28  470  [0207/10]  111.63,182.88 90 top
R29  27  [0207/10]  109.09,182.88 90 top
R30  12  [0207/10]  114.17,182.88 270 top
R31  10K  [0207/10]  142.11,114.3 270 top
R32  1K  [0207/10]  50.67,68.58 270 top
R33  3K  [0207/10]  53.21,68.58 90 top
R34  22K  [0207/10]  124.33,114.3 270 top
R35  15K  [0207/10]  55.75,68.58 90 top
R36  20K  [0207/10]  22.73,101.6 270 top
R37  10K  [0207/10]  20.19,101.6 270 top
R38  100  [0207/10]  124.33,129.54 90 top
R39  470  [0207/10]  238.63,76.2 270 top
R40  5.6K  [0207/10]  149.73,198.12 90 top
R41  5.6K  [0207/10]  149.73,182.88 90 top
R42  5.6K  [0207/10]  149.73,167.64 90 top
R43  5.6K  [0207/10]  149.73,152.4 90 top
R44  5.6K  [0207/10]  149.73,137.16 90 top
R45  5.6K  [0207/10]  154.81,137.16 270 top
R46  5.6K  [0207/10]  147.19,198.12 90 top
R47  5.6K  [0207/10]  147.19,182.88 90 top
R48  5.6K  [0207/10]  147.19,167.64 90 top
R49  5.6K  [0207/10]  147.19,152.4 90 top
R50  5.6K  [0207/10]  147.19,137.16 90 top
R51  5.6K  [0207/10]  152.27,137.16 270 top
R52  470  [0207/10]  111.63,144.78 90 top
R53  470  [0207/10]  177.67,104.14 90 top
S0  J15MM  [15]  200.53,40.64 270 top
S1  J15MM  [15]  197.99,40.64 270 top
S2  J15MM  [15]  203.07,40.64 270 top
S3  J15MM  [15]  205.61,40.64 270 top
S4  J15MM  [15]  192.91,40.64 270 top
S5  J15MM  [15]  195.45,40.64 270 top
S6  J15MM  [15]  190.37,40.64 270 top
S7  J15MM  [15]  187.83,40.64 270 top
S8  J15MM  [15]  88.77,40.64 270 top
S9  J15MM  [15]  91.31,40.64 270 top
S10  J15MM  [15]  86.23,40.64 270 top
S11  J15MM  [15]  83.69,40.64 270 top
U$1  OUTLINE-OMNIBUS  [OMNIBUS]  -0.13,0 0 top
U$2  [EDGE-CON8]  -0.13,0 0 top

## Tracks (layer width: path | path; a pad name or v marks a point on that pad's centre or on a via)
!ACTIVE  (via drill 0.81)
  Top 0.406: v148.46,69.85 148.46,74.3 149.73,75.56 E15.2
  Bottom 0.406: E18.5 140.21,68.58 141.48,69.85 v148.46,69.85 152.91,69.85 156.72,73.66 E15.12
!CLR_D3  (via drill 0.81)
  Top 0.406: v25.91,91.44 25.91,77.47 29.08,74.3 29.08,70.48 30.35,69.22 E33.10
  Bottom 0.406: v25.91,91.44 23.37,93.98 E37.11
!CLR_GO  (via drill 0.81)
  Top 0.406: v139.57,85.09 139.57,82.55 140.21,81.92 140.21,71.12 142.11,69.22 E18.10 | v178.94,86.36 180.21,87.63 180.21,95.89 182.75,98.42 E10.4
  Bottom 0.406: v139.57,85.09 140.84,86.36 v178.94,86.36
!D2  (via drill 0.81)
  Top 0.406: v12.57,113.03 12.57,94.61 15.11,92.08 E37.10 | v133.86,106.68 133.86,80.01 134.49,79.38 E18.1
  Bottom 0.406: v12.57,113.03 13.84,114.3 102.11,114.3 | 102.11,114.3 105.92,114.3 108.46,111.76 E23.1 | 102.11,114.3 108.46,107.95 127.51,107.95 128.78,106.68 E19.4 v133.86,106.68
!DATA00
  Top 0.406: E7.12 220.85,34.92 219.58,33.66 219.58,13.97 U$2.AR1
  Bottom 0.406: E4.10 235.46,35.56 234.19,34.29 222.76,34.29 221.49,35.56 E7.12
!DATA01
  Top 0.406: E7.13 220.85,37.47 217.04,33.66 217.04,13.97 U$2.AS1
  Bottom 0.406: E4.13 236.09,42.55 237.36,41.27 237.36,40.01 236.73,39.37 231.65,39.37 229.11,36.83 222.76,36.83 221.49,38.1 E7.13
!DATA02
  Top 0.406: E7.4 213.23,37.47 214.5,36.2 214.5,29.84 213.87,29.21 210.69,29.21 210.69,13.97 U$2.AU1
  Bottom 0.406: E7.4 213.87,38.1 215.14,39.37 226.57,39.37 227.84,38.1 E4.4
!DATA03  (via drill 0.81)
  Top 0.406: v216.41,43.18 213.87,40.64 E7.3 | v208.15,40.64 205.61,38.1 205.61,34.92 204.34,33.66 204.34,20.95 206.88,18.41 206.88,13.97 U$2.AV1
  Bottom 0.406: v216.41,43.18 217.68,44.45 226.57,44.45 227.84,45.72 E4.1 | E7.3 v208.15,40.64
!DATA04  (via drill 0.81)
  Top 0.406: E14.10 154.81,34.92 150.37,30.48 150.37,13.97 U$2.BR1 | v160.53,35.56 162.43,37.47 E11.4
  Bottom 0.406: E14.10 v160.53,35.56
!DATA05  (via drill 0.81)
  Top 0.406: E14.13 154.81,42.55 148.46,36.2 148.46,15.88 147.19,14.61 147.19,13.97 U$2.BS1 | v160.53,43.18 162.43,41.27 E11.3
  Bottom 0.406: E14.13 v160.53,43.18
!DATA06  (via drill 0.81)
  Top 0.406: v140.84,36.83 140.84,13.97 U$2.BU1
  Bottom 0.406: 145.29,36.83 v140.84,36.83 131.32,36.83 130.68,36.2 115.44,36.2 114.81,35.56 E21.10 | 145.29,36.83 146.56,38.1 E14.4 | 145.29,36.83 163.07,36.83 164.34,35.56 E11.12
!DATA07  (via drill 0.81)
  Top 0.406: E11.13 170.05,37.47 164.34,31.75 156.08,31.75 156.08,43.81 155.45,44.45 147.19,44.45 E14.1 | v137.03,46.99 137.03,13.97 U$2.BV1
  Bottom 0.406: E21.1 107.19,45.72 108.46,46.99 v137.03,46.99 145.29,46.99 146.56,45.72 E14.1
!DATA08  (via drill 0.81)
  Top 0.406: E29.1 37.97,48.26 36.07,48.26 35.43,47.62 35.43,35.56 E32.10 29.72,35.56 29.72,34.29 22.1,34.29 20.19,32.38 20.19,20.95 17.02,17.78 17.02,13.97 U$2.DR1 | v55.75,44.45 55.75,43.81 60.83,38.73 E26.4
  Bottom 0.406: v55.75,44.45 39.88,44.45 38.61,45.72 E29.1
!DATA09  (via drill 0.81)
  Top 0.406: v34.16,40.01 30.99,43.18 E32.13 | v17.02,46.35 17.02,30.48 13.84,27.3 13.84,13.97 U$2.DS1
  Bottom 0.406: E26.3 53.21,40.64 51.94,39.37 39.88,39.37 38.61,38.1 E29.4 36.07,38.1 v34.16,40.01 | v17.02,46.35 18.92,44.45 28.45,44.45 29.72,43.18 E32.13
!DATA10  (via drill 0.81)
  Top 0.406: v7.49,19.68 7.49,13.97 U$2.DU1 | v39.24,26.67 44.32,31.75 44.32,33.66 45.59,34.92 E29.10
  Bottom 0.406: E32.4 23.37,38.1 24.64,36.83 43.69,36.83 44.96,35.56 E29.10 45.59,34.92 53.85,34.92 55.75,36.83 61.47,36.83 62.74,35.56 E26.12 | v7.49,19.68 14.48,26.67 v39.24,26.67
!DATA11  (via drill 0.81)
  Top 0.406: v65.91,43.18 65.91,41.27 68.45,38.73 E26.13 | v3.68,45.72 3.68,13.97 U$2.DV1
  Bottom 0.406: v65.91,43.18 62.74,43.18 61.47,44.45 57.66,44.45 56.39,43.18 E29.13 39.88,43.18 38.61,44.45 29.72,44.45 28.45,45.72 E32.1 22.1,45.72 20.19,47.62 5.59,47.62 v3.68,45.72
!DATA_EN  (via drill 0.81)
  Top 0.406: v102.74,56.52 102.74,64.14 104.01,65.41 E22.6 | v49.4,55.88 45.59,59.69 E30.8
  Bottom 0.406: E36.4 7.49,70.48 6.22,69.22 6.22,60.96 42.42,60.96 44.96,63.5 E30.8 | v102.74,56.52 102.11,55.88 v49.4,55.88
!DEP
  Top 0.406: E22.11 E22.12 111.63,74.3 112.9,75.56 112.9,94.61 109.09,98.42 E23.6
!FIELD  (via drill 0.81)
  Top 0.406: E5.4 225.93,71.75 224.66,73.03 224.66,74.3 225.93,75.56 E5.2 225.93,76.83 215.14,87.63 215.14,106.68 205.61,116.2 205.61,133.35 v203.07,135.89
  Bottom 0.406: v203.07,135.89 4.95,135.89 4.95,85.72 9.4,81.28 19.56,81.28 22.1,78.74 E33.1
!FIELD_EN
  Bottom 0.406: E33.6 23.37,66.04 24.64,67.31 36.07,67.31 37.34,66.04 E30.6
!GO
  Top 0.406: E18.9 142.11,66.67 144.65,69.22 144.65,102.23 138.3,108.58 138.3,112.39 137.67,113.03 129.41,113.03 E19.1
!INIT_ADD
  Top 0.406: E26.9 68.45,27.3 58.29,17.14 58.29,13.97 U$2.DA1 | E5.6 225.93,65.41 223.39,62.87 223.39,31.11 220.85,28.57 E7.9
  Bottom 0.406: 171.96,26.67 170.69,27.94 E11.9 | 171.96,26.67 218.95,26.67 220.22,27.94 E7.9 | 171.96,26.67 161.8,26.67 160.53,27.94 E26.9
!KEY_CONTROL  (via drill 0.81)
  Top 0.406: v96.39,23.5 v96.39,38.1
  Bottom 0.406: v96.39,23.5 95.12,22.23 55.12,22.23 51.31,18.41 10.67,18.41 7.49,15.24 7.49,13.97 U$2.DU2 | v96.39,38.1 E21.4
!LA_ENABLE  (via drill 0.81)
  Top 0.406: v117.35,23.5 117.35,69.85 111,69.85 110.36,70.48 110.36,71.12 E22.4
  Bottom 0.406: v117.35,23.5 120.52,20.32 153.54,20.32 159.89,13.97 U$2.BM2
!LAST
  Bottom 0.406: 147.83,64.77 113.54,64.77 112.27,66.04 E22.9 | 147.83,64.77 149.1,66.04 E15.6 | 147.83,64.77 157.99,64.77 159.26,66.04 E12.6
!LW@TP4
  Top 0.406: E15.4 E15.3
!MEM_START  (via drill 0.81)
  Top 0.406: v101.47,59.69 101.47,72.39 104.65,72.39 105.28,73.03 105.28,76.83 104.01,78.11 E22.1 | v224.66,55.88 225.3,55.24 v225.3,24.13
  Bottom 0.406: v101.47,59.69 105.28,55.88 v224.66,55.88 | v225.3,24.13 234.19,15.24 238,15.24 239.27,13.97 U$2.AJ2
!MSIR_DISABLE  (via drill 0.81)
  Top 0.406: v93.85,77.47 86.23,69.85 86.23,60.33 72.9,46.99 72.9,19.05 73.53,18.41 73.53,13.97 U$2.CV1
  Bottom 0.406: v93.85,77.47 109.73,77.47 111,76.2 E22.13
!POWER_OK  (via drill 0.81)
  Top 0.406: E27.9 E27.10 68.45,69.22 72.26,73.03 72.26,91.44 74.8,93.98 v74.8,118.11 | v97.66,63.5 v97.66,18.41
  Bottom 0.406: 146.56,123.19 261.49,123.19 261.49,75.56 258.95,73.03 253.87,73.03 251.97,71.12 E2.11 | 146.56,123.19 145.29,124.46 Q2.3 | v74.8,118.11 79.88,123.19 146.56,123.19 | v97.66,18.41 114.17,18.41 114.81,19.05 137.03,19.05 137.03,13.97 U$2.BV2 | v97.66,63.5 96.39,64.77 70.36,64.77 69.09,66.04 E27.9
!RUN  (via drill 0.81)
  Top 0.406: E16.9 E16.8 157.35,87 | v157.99,81.28 157.35,81.92 157.35,87 | v142.11,19.05 144.65,21.59 144.65,45.09 153.54,53.98 153.54,83.19 157.35,87
  Bottom 0.406: v157.99,81.28 171.96,81.28 173.23,82.55 211.33,82.55 216.41,77.47 226.57,77.47 230.38,73.66 E5.12 | v142.11,19.05 140.84,19.05 140.84,13.97 U$2.BU2
!START_ADD  (via drill 0.81)
  Top 0.406: v196.09,73.66 185.29,62.87 v185.29,29.21 | v124.33,29.21 124.33,13.97 U$2.CB1
  Bottom 0.406: 160.53,29.21 v124.33,29.21 62.74,29.21 61.47,30.48 E26.7 | 160.53,29.21 161.8,30.48 E11.7 | 160.53,29.21 v185.29,29.21 211.33,29.21 212.6,30.48 E7.7 | v196.09,73.66 E5.3
!STOP  (via drill 0.81)
  Top 0.406: v109.09,26.67 109.09,65.41 111.63,67.94 E22.10 | v17.02,19.68 15.11,17.78 v15.11,15.88
  Bottom 0.406: v109.09,26.67 107.19,24.77 48.77,24.77 43.69,19.68 v17.02,19.68 | v15.11,15.88 13.21,13.97 U$2.DS2
!SYSTEM_CLEAR  (via drill 0.81)
  Top 0.406: v44.32,92.08 44.32,85.72 37.97,79.38 E30.1 | v152.27,93.98 152.27,81.92 149.73,79.38 E15.1
  Bottom 0.406: E30.13 44.96,76.2 42.42,78.74 E30.1 | v44.32,92.08 46.23,93.98 E31.9 48.13,94.61 48.77,95.25 76.71,95.25 77.98,93.98 E25.9 79.25,93.98 80.52,95.25 151,95.25 v152.27,93.98 163.07,93.98 164.34,95.25 203.71,95.25 | 203.71,95.25 204.98,93.98 E9.9 | 203.71,95.25 229.11,95.25 230.38,93.98 E6.9
!TS1  (via drill 0.81)
  Top 0.406: E27.4 E27.5 | v97.66,72.39 99.57,70.48 v99.57,17.14
  Bottom 0.406: v97.66,72.39 62.74,72.39 61.47,71.12 E27.4 | v99.57,17.14 102.74,13.97 U$2.CK2
!TS3  (via drill 0.81)
  Top 0.406: E20.10 E20.9 126.87,65.41 125.6,64.14 v125.6,26.67
  Bottom 0.406: v125.6,26.67 123.7,24.77 108.46,24.77 103.38,19.68 97.03,19.68 96.39,19.05 96.39,13.97 U$2.CM2
+3V3  (via drill 0.81)
  Top 0.635: E37.3 E37.2 | E30.4 37.97,71.75 36.7,73.03 36.7,74.3 37.97,75.56 E30.2 | 43.69,71.12 38.61,76.2 E30.2 | 43.69,71.12 45.59,69.22 E30.10 | 43.69,71.12 45.59,73.03 E30.12 | v21.46,97.79 32.89,97.79 32.89,87 | 32.89,87 32.89,81.92 37.97,76.83 E30.2 | I7.1 I6.1 I4.1 I5.1 I3.1 I2.1 I1.1 I0.1 | I10.1 I8.1 I9.1 | D386.C R52.2 111.63,149.22 114.17,146.69 C6.1 114.17,145.41 107.82,139.06 107.82,111.12 109.09,109.86 E23.2 | 132.59,109.22 133.22,109.22 135.13,107.31 135.13,104.14 137.03,102.23 E19.11 | 132.59,109.22 E19.3 | 132.59,109.22 v132.59,81.28 132.59,78.74 134.49,76.83 E18.2 | v163.07,76.2 163.07,73.66 164.97,71.75 E12.4 | v39.24,87 32.89,87 | v73.53,87 76.07,84.45 I11.1
  Bottom 0.635: v21.46,97.79 11.94,97.79 8.13,101.6 E37.3 | E12.4 165.61,71.12 170.69,76.2 E12.13 173.23,76.2 175.77,78.74 189.74,78.74 192.28,81.28 I7.1 | I10.1 I11.1 | E18.2 E18.13 142.75,76.2 144.02,77.47 161.8,77.47 v163.07,76.2 | E23.2 109.73,109.22 111,110.49 127.51,110.49 128.78,109.22 E19.3 | v132.59,81.28 I9.1 | v73.53,87 v39.24,87
-15V  (via drill 0.81)
  Top 0.635: R9.1 R8.1 R10.1 R11.1 R19.1 R18.1 R17.1 R16.1 186.56,78.74 v186.56,88.9 | R24.1 R25.1 R26.1 R27.1 84.96,80.01 v93.85,88.9 | v55.12,15.88 55.12,36.2 C9.- 53.85,38.73 53.85,44.45 62.1,52.7 62.1,71.12 v65.91,74.93
  Bottom 0.635: v55.12,15.88 55.12,13.97 U$2.DB2 | v65.91,74.93 74.17,74.93 77.34,78.11 R24.1 | v186.56,88.9 v93.85,88.9
ACTIVE  (via drill 0.81)
  Top 0.406: v166.88,63.5 171.96,68.58 E12.10 | v133.22,62.23 133.22,64.14 134.49,65.41 E18.6
  Bottom 0.406: E18.6 133.86,66.04 132.59,67.31 110.36,67.31 110.36,65.41 111.63,64.14 E22.8 111,63.5 109.73,62.23 71.63,62.23 69.09,64.77 17.02,64.77 15.75,66.04 E36.9 | v166.88,63.5 165.61,62.23 v133.22,62.23
C01
  Top 0.406: D1.C D7.C 6.22,192.41 7.49,191.13 7.49,177.8 | 7.49,177.8 D8.C 6.22,177.16 7.49,175.9 7.49,162.56 | 7.49,177.8 D2.C | 7.49,162.56 D9.C 6.22,161.93 7.49,160.66 7.49,147.32 | 7.49,162.56 D3.C | D11.C D5.C | 7.49,147.32 D10.C | 7.49,147.32 D4.C | 7.49,147.32 7.49,133.99 6.22,132.72 D11.C | D12.C 6.22,117.47 4.95,118.75 4.95,130.18 6.22,131.44 D11.C
  Bottom 0.406: D6.C D12.C 6.22,112.39 13.21,105.41 15.75,105.41 27.18,93.98 E34.6
C02
  Top 0.406: D13.C D19.C 12.57,192.41 13.84,191.13 13.84,177.8 | 13.84,177.8 D20.C 12.57,177.16 13.84,175.9 13.84,162.56 | 13.84,177.8 D14.C | 13.84,162.56 D21.C 12.57,161.93 13.84,160.66 13.84,147.32 | 13.84,162.56 D15.C | 13.84,147.32 D22.C 12.57,146.69 13.84,145.41 13.84,132.08 | 13.84,147.32 D16.C | 13.84,132.08 D23.C 12.57,131.44 13.84,130.18 13.84,116.84 | 13.84,132.08 D17.C | 13.84,116.84 D24.C | 13.84,116.84 D18.C 15.11,116.2 21.46,109.86 21.46,106.05 27.81,99.69 E34.4
C03
  Top 0.406: D25.C D31.C 18.92,192.41 20.19,191.13 20.19,177.8 | 20.19,177.8 D32.C 18.92,177.16 20.19,175.9 20.19,162.56 | 20.19,177.8 D26.C | 20.19,162.56 D33.C 18.92,161.93 20.19,160.66 20.19,147.32 | 20.19,162.56 D27.C | 20.19,147.32 D34.C 18.92,146.69 20.19,145.41 20.19,132.08 | 20.19,147.32 D28.C | 20.19,132.08 D35.C 18.92,131.44 20.19,130.18 20.19,116.84 | 20.19,132.08 D29.C | 20.19,116.84 D36.C | 20.19,116.84 D30.C 21.46,111.12 27.81,104.78 E34.2
C04  (via drill 0.81)
  Top 0.406: D37.C D43.C 25.27,192.41 26.54,191.13 26.54,177.8 | 26.54,177.8 D44.C 25.27,177.16 26.54,175.9 26.54,162.56 | 26.54,177.8 D38.C | 26.54,162.56 D45.C 25.27,161.93 26.54,160.66 26.54,147.32 | 26.54,162.56 D39.C | 26.54,147.32 D46.C 25.27,146.69 26.54,145.41 26.54,132.08 | 26.54,147.32 D40.C | 26.54,132.08 D47.C 25.27,131.44 26.54,130.18 26.54,116.84 | 26.54,132.08 D41.C | 26.54,116.84 D48.C | 26.54,116.84 D42.C 27.81,116.2 30.35,113.67 30.35,104.14 v32.89,101.6
  Bottom 0.406: v32.89,101.6 E34.12
C05
  Top 0.406: D49.C D55.C 31.62,192.41 32.89,191.13 32.89,177.8 | 32.89,177.8 D56.C 31.62,177.16 32.89,175.9 32.89,162.56 | 32.89,177.8 D50.C | 32.89,162.56 D57.C 31.62,161.93 32.89,160.66 32.89,147.32 | 32.89,162.56 D51.C | 32.89,147.32 D58.C 31.62,146.69 32.89,145.41 32.89,132.08 | 32.89,147.32 D52.C | 32.89,132.08 D59.C 31.62,131.44 32.89,130.18 32.89,116.84 | 32.89,132.08 D53.C | 32.89,116.84 D60.C | 32.89,116.84 D54.C 34.16,116.2 36.7,113.67 36.7,98.42 35.43,97.16 E34.10
C06
  Top 0.406: D61.C D67.C 37.97,192.41 39.24,191.13 39.24,177.8 | 39.24,177.8 D68.C 37.97,177.16 39.24,175.9 39.24,162.56 | 39.24,177.8 D62.C | 39.24,162.56 D69.C 37.97,161.93 39.24,160.66 39.24,147.32 | 39.24,162.56 D63.C | 39.24,147.32 D70.C 37.97,146.69 39.24,145.41 39.24,132.08 | 39.24,147.32 D64.C | 39.24,132.08 D71.C 37.97,131.44 39.24,130.18 39.24,116.84 | 39.24,132.08 D65.C | E34.8 35.43,92.08 37.97,94.61 D72.C 39.24,116.84 | 39.24,116.84 D66.C
C07
  Top 0.406: D73.C D79.C 44.32,192.41 45.59,191.13 45.59,177.8 | 45.59,177.8 D80.C 44.32,177.16 45.59,175.9 45.59,162.56 | 45.59,177.8 D74.C | 45.59,162.56 D81.C 44.32,161.93 45.59,160.66 45.59,147.32 | 45.59,162.56 D75.C | 45.59,147.32 D82.C 44.32,146.69 45.59,145.41 45.59,132.08 | 45.59,147.32 D76.C | 45.59,132.08 D83.C 44.32,131.44 45.59,130.18 45.59,116.84 | 45.59,132.08 D77.C | 45.59,116.84 D84.C | 45.59,116.84 D78.C 46.86,116.2 49.4,113.67 49.4,100.97 55.75,94.61 E28.6
C08
  Top 0.406: D85.C D91.C 50.67,192.41 51.94,191.13 51.94,177.8 | 51.94,177.8 D92.C 50.67,177.16 51.94,175.9 51.94,162.56 | 51.94,177.8 D86.C | 51.94,162.56 D93.C 50.67,161.93 51.94,160.66 51.94,147.32 | 51.94,162.56 D87.C | 51.94,147.32 D94.C 50.67,146.69 51.94,145.41 51.94,132.08 | 51.94,147.32 D88.C | 51.94,132.08 D95.C 50.67,131.44 51.94,130.18 51.94,116.84 | 51.94,132.08 D89.C | 51.94,116.84 D96.C | 51.94,116.84 D90.C 53.21,102.23 55.75,99.69 E28.4
C09
  Top 0.406: D97.C D103.C 57.02,192.41 58.29,191.13 58.29,177.8 | 58.29,177.8 D104.C 57.02,177.16 58.29,175.9 58.29,162.56 | 58.29,177.8 D98.C | 58.29,162.56 D105.C 57.02,161.93 58.29,160.66 58.29,147.32 | 58.29,162.56 D99.C | 58.29,147.32 D106.C 57.02,146.69 58.29,145.41 58.29,132.08 | 58.29,147.32 D100.C | 58.29,132.08 D107.C 57.02,131.44 58.29,130.18 58.29,116.84 | 58.29,132.08 D101.C | E28.2 55.75,104.78 59.56,108.58 D102.C 58.29,116.84 | 58.29,116.84 D108.C
C10
  Top 0.406: D109.C D115.C 63.37,192.41 64.64,191.13 64.64,177.8 | 64.64,177.8 D116.C 63.37,177.16 64.64,175.9 64.64,162.56 | 64.64,177.8 D110.C | 64.64,162.56 D117.C 63.37,161.93 64.64,160.66 64.64,147.32 | 64.64,162.56 D111.C | 64.64,147.32 D118.C 63.37,146.69 64.64,145.41 64.64,132.08 | 64.64,147.32 D112.C | 64.64,132.08 D119.C 63.37,131.44 64.64,130.18 64.64,116.84 | 64.64,132.08 D113.C | E28.12 63.37,102.23 65.91,104.78 D114.C 64.64,116.84 | 64.64,116.84 D120.C
C11
  Top 0.406: E28.10 63.37,97.16 67.18,100.97 67.18,113.67 69.72,116.2 D132.C | D121.C D127.C 69.72,192.41 70.99,191.13 70.99,177.8 | 70.99,177.8 D128.C 69.72,177.16 70.99,175.9 70.99,162.56 | 70.99,177.8 D122.C | 70.99,162.56 D129.C 69.72,161.93 70.99,160.66 70.99,147.32 | 70.99,162.56 D123.C | 70.99,147.32 D130.C | 70.99,147.32 D124.C | 70.99,147.32 70.99,133.99 69.72,132.72 D131.C | D126.C 72.26,117.47 73.53,118.75 73.53,130.18 72.26,131.44 D125.C
  Bottom 0.406: D126.C D132.C | D131.C D125.C
C12
  Top 0.406: D133.C D139.C 76.07,192.41 77.34,191.13 77.34,177.8 | 77.34,177.8 D140.C 76.07,177.16 77.34,175.9 77.34,162.56 | 77.34,177.8 D134.C | 77.34,162.56 D141.C 76.07,161.93 77.34,160.66 77.34,147.32 | 77.34,162.56 D135.C | 77.34,147.32 D142.C 76.07,146.69 74.8,145.41 74.8,133.35 | 77.34,147.32 D136.C | D138.C D144.C 76.07,117.47 77.34,118.75 77.34,132.08 | 74.8,133.35 76.07,133.35 D143.C 77.34,132.08 | 74.8,133.35 71.63,133.35 70.99,132.72 70.99,116.2 68.45,113.67 68.45,97.16 63.37,92.08 E28.8 | 77.34,132.08 D137.C
C13
  Top 0.406: D145.C D151.C 82.42,192.41 83.69,191.13 83.69,177.8 | 83.69,177.8 D152.C 82.42,177.16 83.69,175.9 83.69,162.56 | 83.69,177.8 D146.C | 83.69,162.56 D153.C 82.42,161.93 83.69,160.66 83.69,147.32 | 83.69,162.56 D147.C | 83.69,147.32 D154.C 82.42,146.69 83.69,145.41 83.69,132.08 | 83.69,147.32 D148.C | 83.69,132.08 D155.C 82.42,131.44 83.69,130.18 83.69,116.84 | 83.69,132.08 D149.C | 83.69,116.84 D156.C | 83.69,116.84 D150.C 84.96,106.05 86.23,104.78 E24.2
C14
  Top 0.406: D157.C D163.C 88.77,192.41 90.04,191.13 90.04,177.8 | 90.04,177.8 D164.C 88.77,177.16 90.04,175.9 90.04,162.56 | 90.04,177.8 D158.C | 90.04,162.56 D165.C 88.77,161.93 90.04,160.66 90.04,147.32 | D159.C 90.04,162.56 | 90.04,147.32 D166.C 88.77,146.69 90.04,145.41 90.04,132.08 | 90.04,147.32 D160.C | 90.04,132.08 D167.C 88.77,131.44 90.04,130.18 90.04,116.84 | 90.04,132.08 D161.C | 90.04,116.84 D168.C | 90.04,116.84 D162.C 91.31,104.78 93.85,102.23 E24.12
C15
  Top 0.406: D169.C D175.C 95.12,192.41 96.39,191.13 96.39,177.8 | 96.39,177.8 D176.C 95.12,177.16 96.39,175.9 96.39,162.56 | 96.39,177.8 D170.C | 96.39,162.56 D177.C 95.12,161.93 96.39,160.66 96.39,147.32 | 96.39,162.56 D171.C | 96.39,147.32 D178.C 95.12,146.69 96.39,145.41 96.39,132.08 | 96.39,147.32 D172.C | 96.39,132.08 D179.C 95.12,131.44 96.39,130.18 96.39,116.84 | 96.39,132.08 D173.C | E24.10 93.85,97.16 95.12,98.42 D180.C 96.39,116.84 | 96.39,116.84 D174.C
C16  (via drill 0.81)
  Top 0.406: D181.C D187.C 101.47,192.41 102.74,191.13 102.74,177.8 | 102.74,177.8 D188.C 101.47,177.16 102.74,175.9 102.74,162.56 | 102.74,177.8 D182.C | 102.74,162.56 D189.C 101.47,161.93 102.74,160.66 102.74,147.32 | 102.74,162.56 D183.C | 102.74,147.32 D190.C 101.47,146.69 102.74,145.41 102.74,132.08 | 102.74,147.32 D184.C | 102.74,132.08 D191.C 101.47,131.44 102.74,130.18 102.74,116.84 | 102.74,132.08 D185.C | v96.39,91.44 101.47,96.52 D192.C 102.74,116.84 | 102.74,116.84 D186.C
  Bottom 0.406: v96.39,91.44 E24.8
C17  (via drill 0.81)
  Top 0.406: D193.C D199.C 162.43,192.41 163.7,191.13 163.7,177.8 | 163.7,177.8 D200.C 162.43,177.16 163.7,175.9 163.7,162.56 | 163.7,177.8 D194.C | 163.7,162.56 D201.C 162.43,161.93 163.7,160.66 163.7,147.32 | 163.7,162.56 D195.C | 163.7,147.32 D202.C 162.43,146.69 163.7,145.41 163.7,132.08 | 163.7,147.32 D196.C | 163.7,132.08 D203.C 162.43,131.44 163.7,130.18 163.7,116.84 | 163.7,132.08 D197.C | D204.C 163.7,116.84 | 163.7,116.84 D198.C | v180.21,115.57 180.21,107.31 182.75,104.78 E10.2
  Bottom 0.406: v180.21,115.57 166.88,115.57 165.61,116.84 D198.C
C18  (via drill 0.81)
  Top 0.406: v177.67,102.87 173.86,106.68 173.86,113.03 171.32,115.57 D210.C | D205.C D211.C 168.78,192.41 170.05,191.13 170.05,177.8 | 170.05,177.8 D212.C 168.78,177.16 170.05,175.9 170.05,162.56 | 170.05,177.8 D206.C | 170.05,162.56 D213.C 168.78,161.93 170.05,160.66 170.05,147.32 | 170.05,162.56 D207.C | D215.C D209.C | 170.05,147.32 D214.C | 170.05,147.32 D208.C | 170.05,147.32 170.05,133.99 168.78,132.72 D215.C | D216.C 168.78,117.47 167.51,118.75 167.51,130.18 168.78,131.44 D215.C
  Bottom 0.406: D210.C D216.C | v177.67,102.87 188.47,102.87 189.74,101.6 E10.12
C19  (via drill 0.81)
  Top 0.406: D217.C D223.C 175.13,192.41 173.86,191.13 173.86,175.9 | D218.C D224.C 175.13,177.16 173.86,175.9 | D219.C D225.C 175.13,161.93 173.86,160.66 | D220.C D226.C 175.13,146.69 173.86,145.41 | D227.C D221.C | 176.4,116.84 D228.C | 176.4,116.84 D222.C 177.67,116.2 178.94,114.94 178.94,102.87 v181.48,100.33 | 176.4,116.84 176.4,130.18 175.13,131.44 D227.C | 173.86,145.41 173.86,133.99 175.13,132.72 D227.C | 173.86,145.41 173.86,160.66 | 173.86,160.66 173.86,175.9
  Bottom 0.406: v181.48,100.33 185.93,100.33 189.74,96.52 E10.10
C20
  Top 0.406: D229.C D235.C 181.48,192.41 182.75,191.13 182.75,177.8 | 182.75,177.8 D236.C 181.48,177.16 182.75,175.9 182.75,162.56 | 182.75,177.8 D230.C | 182.75,162.56 D237.C 181.48,161.93 182.75,160.66 182.75,147.32 | 182.75,162.56 D231.C | 182.75,147.32 D238.C 181.48,146.69 182.75,145.41 182.75,132.08 | 182.75,147.32 D232.C | 182.75,132.08 D239.C 181.48,131.44 182.75,130.18 182.75,116.84 | 182.75,132.08 D233.C | 182.75,116.84 D240.C | 182.75,116.84 D234.C 184.02,116.2 186.56,113.67 186.56,95.89 190.37,92.08 E10.8
C21
  Top 0.406: D241.C D247.C 187.83,192.41 189.1,191.13 189.1,177.8 | 189.1,177.8 D248.C 187.83,177.16 189.1,175.9 189.1,162.56 | 189.1,177.8 D242.C | 189.1,162.56 D249.C 187.83,161.93 189.1,160.66 189.1,147.32 | 189.1,162.56 D243.C | 189.1,147.32 D250.C 187.83,146.69 189.1,145.41 189.1,132.08 | 189.1,147.32 D244.C | 189.1,132.08 D251.C 187.83,131.44 189.1,130.18 189.1,116.84 | 189.1,132.08 D245.C | E8.6 212.6,93.98 206.25,100.33 187.83,100.33 D252.C 189.1,116.84 | 189.1,116.84 D246.C
C22
  Top 0.406: E8.4 212.6,99.06 208.79,102.87 196.72,102.87 D258.C 196.72,117.47 197.99,118.75 197.99,130.18 196.72,131.44 D257.C D263.C 194.18,132.72 195.45,133.99 195.45,147.32 | D253.C D259.C 194.18,192.41 195.45,191.13 195.45,177.8 | 195.45,177.8 D260.C 194.18,177.16 195.45,175.9 195.45,162.56 | 195.45,177.8 D254.C | 195.45,162.56 D261.C 194.18,161.93 195.45,160.66 195.45,147.32 | 195.45,162.56 D255.C | 195.45,147.32 D262.C | 195.45,147.32 D256.C
  Bottom 0.406: D258.C D264.C
C23